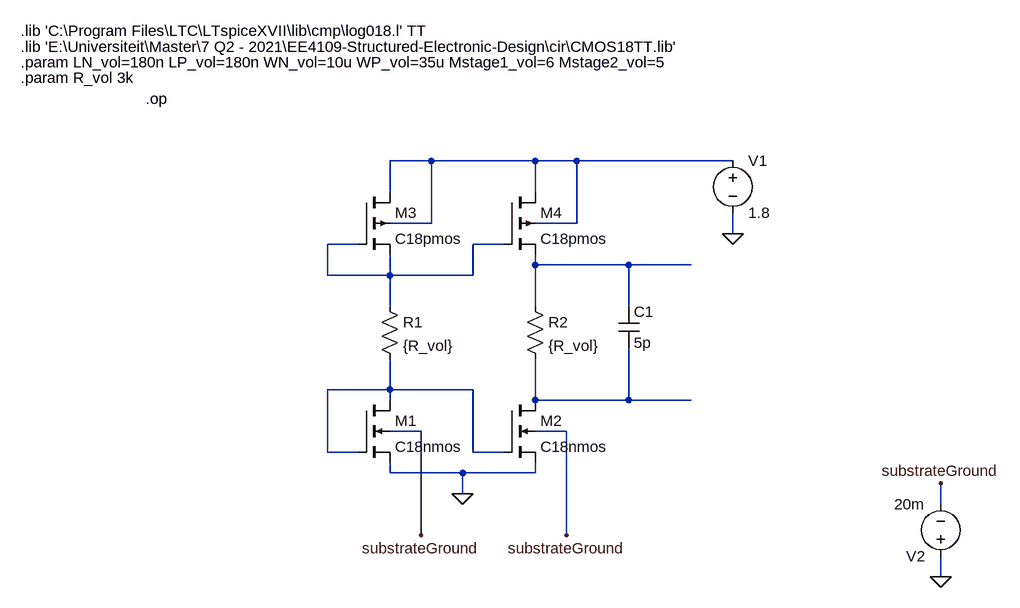
[diagram p0: schematic BiasingFloatingSource.asc]
BiasingFloatingSource.asc, the LTspice schematic file:
Version 4
SHEET 1 948 680
WIRE 128 -240 64 -240
WIRE 288 -240 128 -240
WIRE 352 -240 288 -240
WIRE 592 -240 352 -240
WIRE 64 -192 64 -240
WIRE 288 -192 288 -240
WIRE 128 -144 128 -240
WIRE 128 -144 64 -144
WIRE 352 -144 352 -240
WIRE 352 -144 288 -144
WIRE 592 -128 592 -160
WIRE 16 -112 -32 -112
WIRE 240 -112 192 -112
WIRE 288 -80 288 -96
WIRE 432 -80 288 -80
WIRE 528 -80 432 -80
WIRE -32 -64 -32 -112
WIRE 64 -64 64 -96
WIRE 64 -64 -32 -64
WIRE 192 -64 192 -112
WIRE 192 -64 64 -64
WIRE 64 -16 64 -64
WIRE 288 -16 288 -80
WIRE 432 -16 432 -80
WIRE 64 112 64 64
WIRE 64 112 -32 112
WIRE 192 112 64 112
WIRE 64 128 64 112
WIRE 288 128 288 64
WIRE 432 128 432 48
WIRE 432 128 288 128
WIRE 528 128 432 128
WIRE 112 176 64 176
WIRE 336 176 288 176
WIRE -32 208 -32 112
WIRE 16 208 -32 208
WIRE 192 208 192 112
WIRE 240 208 192 208
WIRE 64 240 64 224
WIRE 176 240 64 240
WIRE 288 240 288 224
WIRE 288 240 176 240
WIRE 176 272 176 240
WIRE 912 288 912 256
WIRE 112 336 112 176
WIRE 336 336 336 176
WIRE 912 400 912 368
FLAG 592 -128 0
FLAG 912 256 substrateGround
FLAG 912 400 0
FLAG 176 272 0
FLAG 336 336 substrateGround
FLAG 112 336 substrateGround
DATAFLAG 528 128 ""
DATAFLAG 528 -80 ""
SYMBOL nmos4 16 128 R0
SYMATTR InstName M1
SYMATTR Value C18nmos
SYMATTR Value2 l={LN_vol} w={WN_vol} m={Mstage1_vol}
SYMBOL pmos4 16 -192 R0
SYMATTR InstName M3
SYMATTR Value C18pmos
SYMATTR Value2 l={LP_vol} w={WP_vol} m={Mstage1_vol}
SYMBOL res 48 -32 R0
SYMATTR InstName R1
SYMATTR Value {R_vol}
SYMBOL voltage 592 -256 R0
WINDOW 123 0 0 Left 0
WINDOW 39 0 0 Left 0
SYMATTR InstName V1
SYMATTR Value 1.8
SYMBOL voltage 912 384 R180
WINDOW 123 0 0 Left 0
WINDOW 39 0 0 Left 0
SYMATTR InstName V2
SYMATTR Value 20m
SYMBOL cap 416 -16 R0
SYMATTR InstName C1
SYMATTR Value 5p
SYMBOL nmos4 240 128 R0
SYMATTR InstName M2
SYMATTR Value C18nmos
SYMATTR Value2 l={LN_vol} w={WN_vol} m={Mstage2_vol}
SYMBOL pmos4 240 -192 R0
SYMATTR InstName M4
SYMATTR Value C18pmos
SYMATTR Value2 l={LP_vol} w={WP_vol} m={Mstage2_vol}
SYMBOL res 272 -32 R0
SYMATTR InstName R2
SYMATTR Value {R_vol}
TEXT -312 -336 Left 2 !.op
TEXT -504 -416 Left 2 !.lib 'E:\\Universiteit\\Master\\7 Q2 - 2021\\EE4109-Structured-Electronic-Design\\cir\\CMOS18TT.lib'
TEXT -504 -440 Left 2 !.lib 'C:\\Program Files\\LTC\\LTspiceXVII\\lib\\cmp\\log018.l' TT
TEXT -504 -392 Left 2 !.param LN_vol=180n LP_vol=180n WN_vol=10u WP_vol=35u Mstage1_vol=6 Mstage2_vol=5
TEXT -504 -368 Left 2 !.param R_vol 3k

The netlist it stands for:
* BiasingFloatingSource.asc
M1 N004 N004 0 substrateGround C18nmos l={LN_vol} w={WN_vol} m={Mstage1_vol}
M3 N001 N002 N002 N001 C18pmos l={LP_vol} w={WP_vol} m={Mstage1_vol}
R1 N002 N004 {R_vol}
V1 N001 0 1.8
V2 0 substrateGround 20m
C1 N003 N005 5p
M2 N005 N004 0 substrateGround C18nmos l={LN_vol} w={WN_vol} m={Mstage2_vol}
M4 N001 N002 N003 N001 C18pmos l={LP_vol} w={WP_vol} m={Mstage2_vol}
R2 N003 N005 {R_vol}
.model NMOS NMOS
.model PMOS PMOS
.lib standard.mos
.op
.lib 'E:\Universiteit\Master\7 Q2 - 2021\EE4109-Structured-Electronic-Design\cir\CMOS18TT.lib'
.lib 'C:\Program Files\LTC\LTspiceXVII\lib\cmp\log018.l' TT
.param LN_vol=180n LP_vol=180n WN_vol=10u WP_vol=35u Mstage1_vol=6 Mstage2_vol=5
.param R_vol 3k
.backanno
.end